# EAGLE design OperationShield1 (EAGLE 5.12)
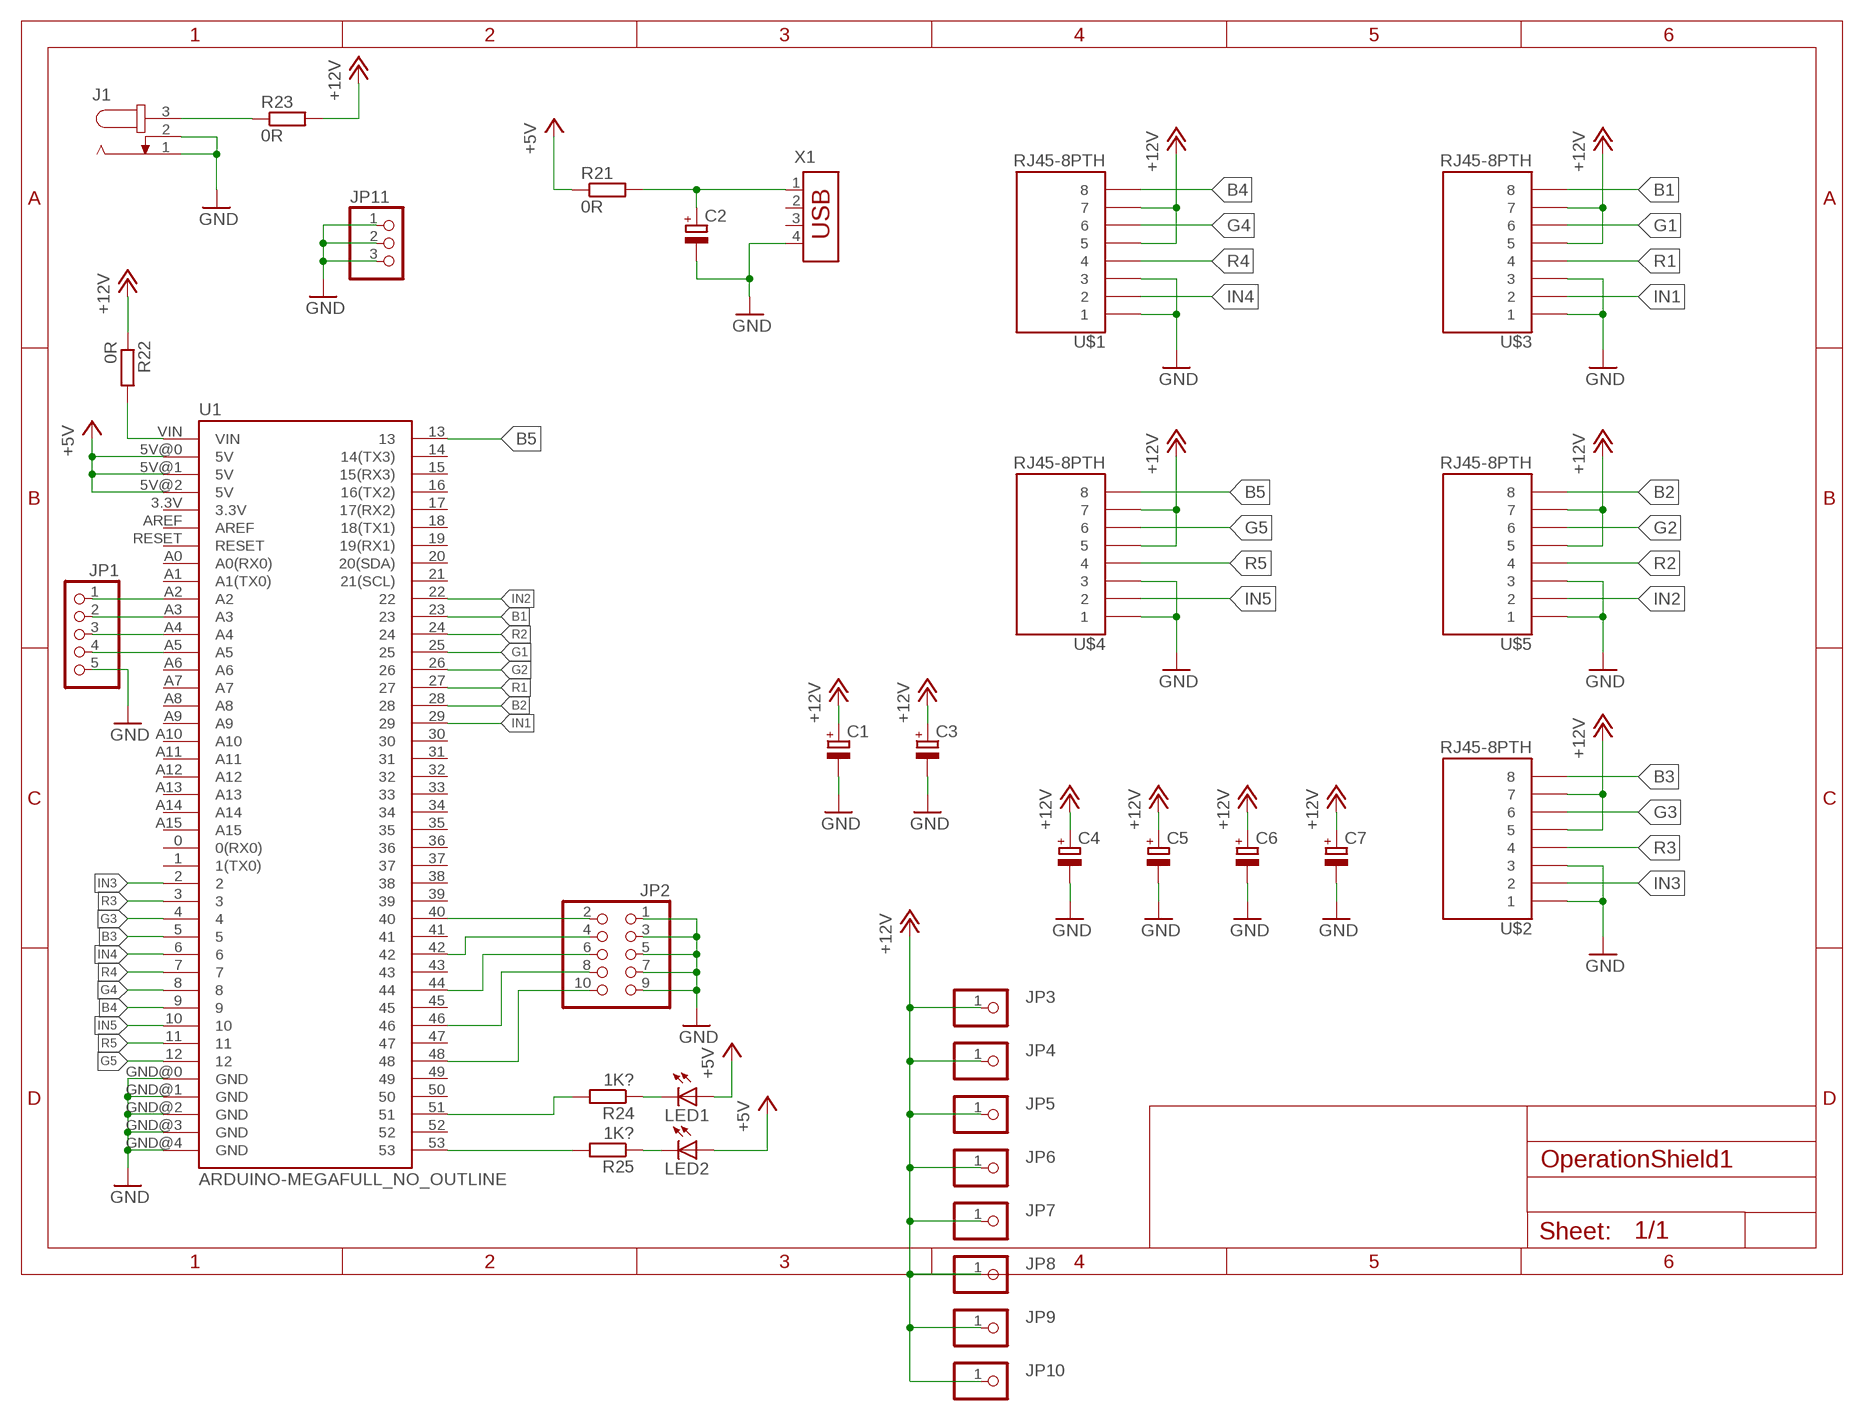
[diagram p0: schematic, sheet 1]

## Parts
C1  CPOL-EUE3.5-10  [E3,5-10]
C2  CPOL-EUE3.5-10  [E3,5-10]
C3  CPOL-EUE3.5-10  [E3,5-10]
C4  CPOL-EUE3.5-10  [E3,5-10]
C5  CPOL-EUE3.5-10  [E3,5-10]
C6  CPOL-EUE3.5-10  [E3,5-10]
C7  CPOL-EUE3.5-10  [E3,5-10]
J1  JACK-PLUG0  [SPC4077]
JP1  PINHD-1X5  [1X05]
JP2  PINHD-2X5  [2X05]
JP3  PINHD-1X1  [1X01]
JP4  PINHD-1X1  [1X01]
JP5  PINHD-1X1  [1X01]
JP6  PINHD-1X1  [1X01]
JP7  PINHD-1X1  [1X01]
JP8  PINHD-1X1  [1X01]
JP9  PINHD-1X1  [1X01]
JP10  PINHD-1X1  [1X01]
JP11  PINHD-1X3  [1X03]
LED1  LED5MM  [LED5MM]
LED2  LED5MM  [LED5MM]
R21  0R  R-EU_0207/10  [0207/10]
R22  0R  R-EU_0207/10  [0207/10]
R23  0R  R-EU_0207/10  [0207/10]
R24  1K?  R-EU_0207/10  [0207/10]
R25  1K?  R-EU_0207/10  [0207/10]
U1  ARDUINO-MEGAFULL_NO_OUTLINE  [ARDUINO_MEGA_NO_OUTLINE]
U$1  RJ45-8PTH  [RJ45-8]
U$2  RJ45-8PTH  [RJ45-8]
U$3  RJ45-8PTH  [RJ45-8]
U$4  RJ45-8PTH  [RJ45-8]
U$5  RJ45-8PTH  [RJ45-8]
X1  USB-787616  [USB]

## Nets
+5V: LED1.A LED2.A R21.1 U1.5V@0(5V) U1.5V@1(5V) U1.5V@2(5V)
+12V [power]: C1.+ C3.+ C4.+ C5.+ C6.+ C7.+ JP3.1 JP4.1 JP5.1 JP6.1 JP7.1 JP8.1 JP9.1 JP10.1 R22.1 R23.2 U$1.5 U$1.7 U$2.5 U$2.7 U$3.5 U$3.7 U$4.5 U$4.7 U$5.5 U$5.7
A2: JP1.1 U1.A2
A3: JP1.2 U1.A3
A4: JP1.3 U1.A4
A5: JP1.4 U1.A5
B1: U1.23 U$3.8
B2: U1.28 U$5.8
B3 [signal]: U1.5 U$2.8
B4: U1.9 U$1.8
B5 [signal]: U1.13 U$4.8
G1: U1.25 U$3.6
G2: U1.26 U$5.6
G3 [signal]: U1.4 U$2.6
G4: U1.8 U$1.6
G5 [signal]: U1.12 U$4.6
GND [power]: C1.- C2.- C3.- C4.- C5.- C6.- C7.- J1.1 J1.2 JP2.1 JP2.3 JP2.5 JP2.7 JP2.9 JP11.1 JP11.2 JP11.3 U1.GND@0(GND) U1.GND@1(GND) U1.GND@2(GND) U1.GND@3(GND) U1.GND@4(GND) U$1.1 U$1.3 U$2.1 U$2.3 U$3.1 U$3.3 U$4.1 U$4.3 U$5.1 U$5.3 X1.4
IN1: U1.29 U$3.2
IN2: U1.22 U$5.2
IN3: U1.2 U$2.2
IN4: U1.6 U$1.2
IN5 [signal]: U1.10 U$4.2
LED1: R24.2 U1.51
LED2: R25.2 U1.53
N$6: JP1.5 ; supply symbol labelled GND
N$21: LED2.K(C) R25.1
N$22: LED1.K(C) R24.1
N$23 [signal]: JP2.10 U1.48
N$24 [signal]: JP2.8 U1.46
N$25 [signal]: JP2.6 U1.44
N$26 [signal]: JP2.4 U1.42
N$27 [signal]: JP2.2 U1.40
R1: U1.27 U$3.4
R2: U1.24 U$5.4
R3 [signal]: U1.3 U$2.4
R4: U1.7 U$1.4
R5 [signal]: U1.11 U$4.4
USB_V+ [power]: C2.+ R21.2 X1.1
VIN [power]: R22.2 U1.VIN
VJACK [power]: J1.3 R23.1
Unconnected: U1.0(0(RX0)) U1.1(1(TX0)) U1.3.3V U1.14(14(TX3)) U1.15(15(RX3)) U1.16(16(TX2)) U1.17(17(RX2)) U1.18(18(TX1)) U1.19(19(RX1)) U1.20(20(SDA)) U1.21(21(SCL)) U1.30 U1.31 U1.32 U1.33 U1.34 U1.35 U1.36 U1.37 U1.38 U1.39 U1.41 U1.43 U1.45 U1.47 U1.49 U1.50 U1.52 U1.A0(A0(RX0)) U1.A1(A1(TX0)) U1.A6 U1.A7 U1.A8 U1.A9 U1.A10 U1.A11 U1.A12 U1.A13 U1.A14 U1.A15 U1.AREF U1.RESET X1.2 X1.3

## Library data of the parts
C1-C7 = rcl:CPOL-EU: POLARIZED CAPACITOR, European symbol
J1 = con-jack:JACK-PLUG: DC POWER JACK Power Jack, DC, Right Angle, Through Hole, Rated 5A at 16VDC, PC Terminals Distributor: Farnell (www.Farnell.de) Drawing: 84N1161.pdf / 84N1162.pdf Manufacturer: SPC Technology (www.spctechnology.com) Type: SPC4077 / SPC 4078; OC_FARNELL: unknown; OC_NEWARK: unknown
JP1 = pinhead:PINHD-1X5: PIN HEADER
JP2 = pinhead:PINHD-2X5: PIN HEADER
JP3-JP10 = pinhead:PINHD-1X1: PIN HEADER
JP11 = pinhead:PINHD-1X3: PIN HEADER
LED1 LED2 = led:LED: LED OSRAM: - CHIPLED LG R971, LG N971, LY N971, LG Q971, LY Q971, LO R971, LY R971 LH N974, LH R974 LS Q976, LO Q976, LY Q976 LO Q996 - Hyper CHIPLED LW Q18S LB Q993, LB Q99A, LB R99A - SideLED LS A670, LO A670, LY A670, LG A670, LP A670 LB A673, LV A673, LT A673, LW A673 LH A674 LY A675 LS A676, LA A676, LO A676, LY A676, LW A676 LS A679, LY A679, LG A679 - Hyper Micro SIDELED® LS Y876, LA Y876, LO Y876, LY Y876 LT Y87S - SmartLED LW L88C, LW L88S LB L89C, LB L89S, LG L890 LS L89K, LO L89K, LY L89K LS L896, LA L896, LO L896, LY L896 - TOPLED LS T670, LO T670, LY T670, LG T670, LP T670 LSG T670, LSP T670, LSY T670, LOP T670, LYG T670 LG T671, LOG T671, LSG T671 LB T673, LV T673, LT T673, LW T673 LH T674 LS T676, LA T676, LO T676, LY T676, LB T676, LH T676, LSB T676, LW T676 LB T67C, LV T67C, LT T67C, LS T67K, LO T67K, LY T67K, LW E67C LS E67B, LA E67B, LO E67B, LY E67B, LB E67C, LV E67C, LT E67C LW T67C LS T679, LY T679, LG T679 LS T770, LO T770, LY T770, LG T770, LP T770 LB T773, LV T773, LT T773, LW T773 LH T774 LS E675, LA E675, LY E675, LS T675 LS T776, LA T776, LO T776, LY T776, LB T776 LHGB T686 LT T68C, LB T68C - Hyper Mini TOPLED® LB M676 - Mini TOPLED Santana® LG M470 LS M47K, LO M47K, LY M47K Source: http://www.osram.convergy.de LUXEON: - LUMILED® LXK2-PW12-R00, LXK2-PW12-S00, LXK2-PW14-U00, LXK2-PW14-V00 LXK2-PM12-R00, LXK2-PM12-S00, LXK2-PM14-U00 LXK2-PE12-Q00, LXK2-PE12-R00, LXK2-PE12-S00, LXK2-PE14-T00, LXK2-PE14-U00 LXK2-PB12-K00, LXK2-PB12-L00, LXK2-PB12-M00, LXK2-PB14-N00, LXK2-PB14-P00, LXK2-PB14-Q00 LXK2-PR12-L00, LXK2-PR12-M00, LXK2-PR14-Q00, LXK2-PR14-R00 LXK2-PD12-Q00, LXK2-PD12-R00, LXK2-PD12-S00 LXK2-PH12-R00, LXK2-PH12-S00 LXK2-PL12-P00, LXK2-PL12-Q00, LXK2-PL12-R00 Source: www.luxeon.com KINGBRIGHT: KA-3528ASYC Source: www.kingbright.com
R21-R25 = resistor:R-EU_: RESISTOR, European symbol
U1 = SparkFun:ARDUINO-MEGA: Arduino Mega footprint connections
U$1-U$5 = SparkFun:RJ45-8: RJ45 Jack Simple RJ45, 8-pin connection - connector for common Cat5, Cat5e, and Cat6 Ethernet cables. Footprint not yet proven in production. Connector sku is PRT-00643; Breakout PCB sku is BOB-00716.
X1 = con-amp:USB-787616: AMP connector; MF: TYCO ELECTRONICS; MPN: 787616-1; OC_FARNELL: unknown; OC_NEWARK: 83F4514

## Net classes
1 signal: width 0.406 mm, clearance 0.406 mm
2 power: width 0.61 mm, clearance 0.406 mm

## Board
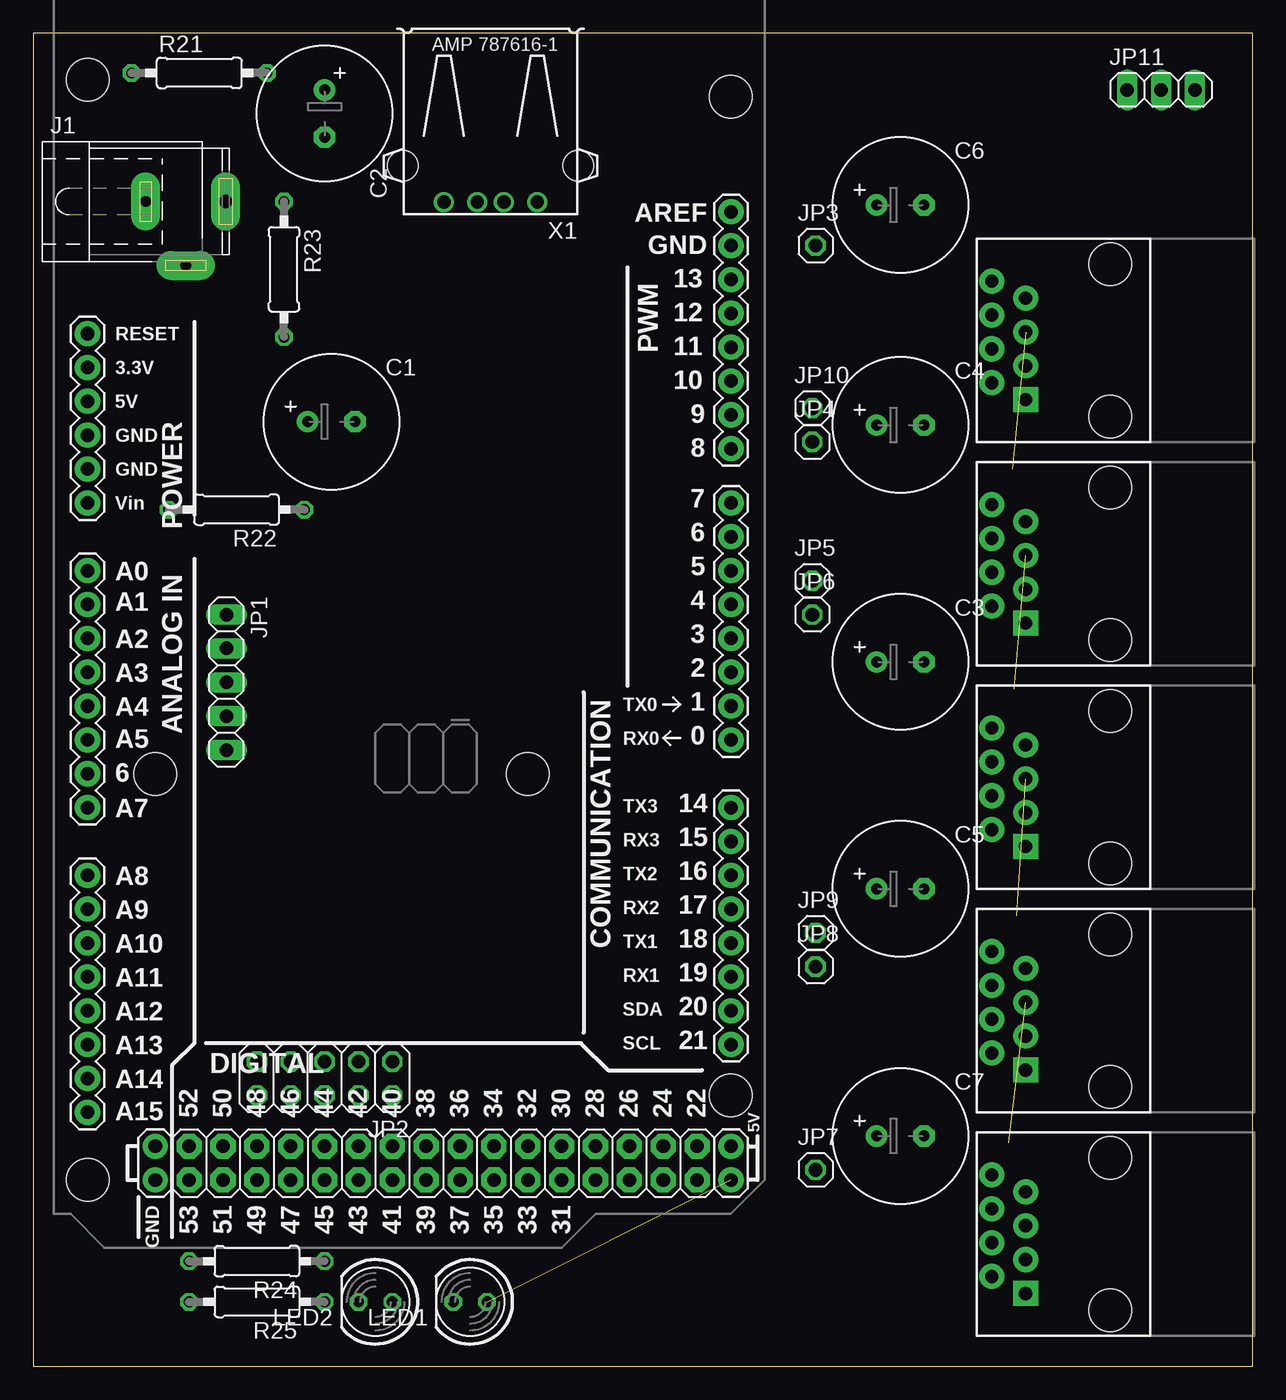
[diagram p1: board, top side]
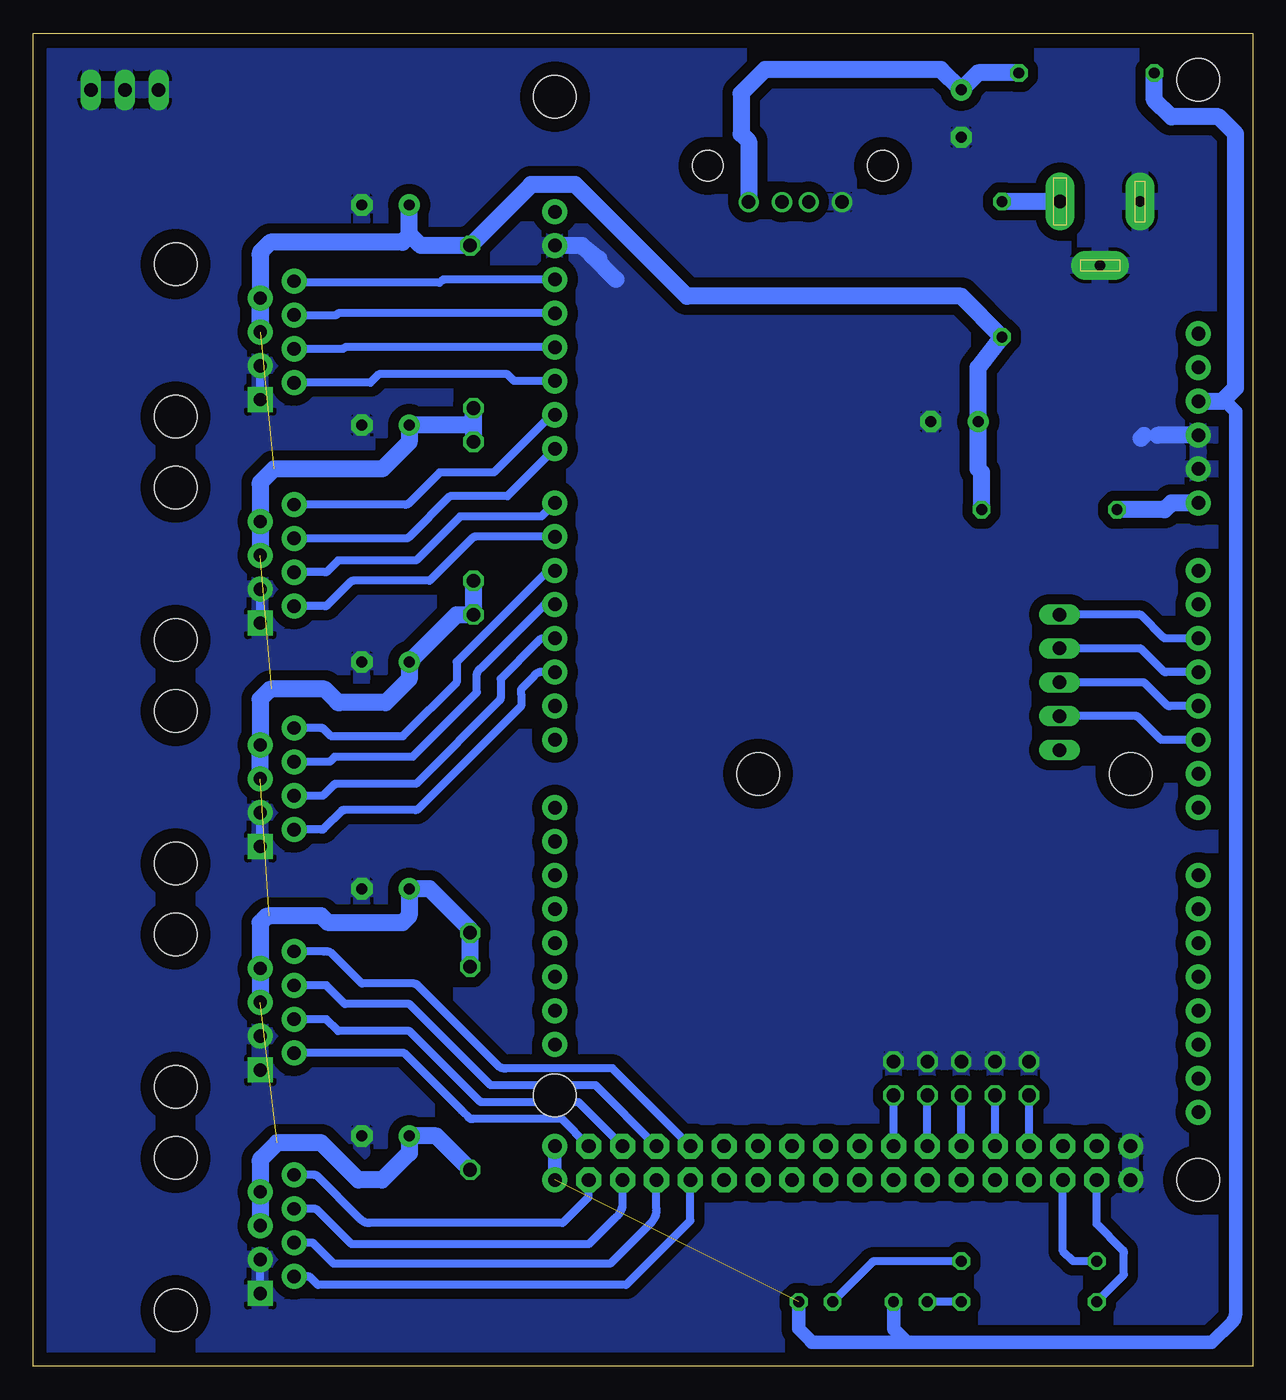
[diagram p2: board, bottom side, seen from below]

Size 91.44 x 100 mm. Coordinates in mm from the lower left corner, seen from the top.
Outline: 0,0 91.44,0 91.44,100 0,100 0,0
Copper layers (1*16): Top 0.035mm / dielectric 1.5mm / Bottom 0.035mm
Design rules "default": minimum track width 10mil, minimum drill 24mil, track to track 8mil, track to pad 8mil, pad to pad 8mil, via to via 8mil, smd to smd 8mil, copper to edge 40mil, drill to drill 8mil, minimum pad ring 10mil, minimum via ring 8mil, stop-mask expansion 4mil, vias tented up to drill 0mil, thermal gap 10mil

### Footprints (pad centres in the part's own frame; a part is rotated, then mirrored left to right if it is on the bottom)
E3,5-10 = drill 0.813 pad 1.6 round: + -1.778,0 | drill 0.813 pad 1.6 octagon: - 1.778,0
SPC4077 = drill 0.8 pad 2.184 long: 1 -3,0; 2 0,-4.8 | drill 1 pad 2.184 long: 3 3,0
1X05 = drill 1.016 long: 1 -5.08,0; 2 -2.54,0; 3 0,0; 4 2.54,0; 5 5.08,0
2X05 = drill 1.016 octagon: 1 -5.08,-1.27; 2 -5.08,1.27; 3 -2.54,-1.27; 4 -2.54,1.27; 5 0,-1.27; 6 0,1.27; 7 2.54,-1.27; 8 2.54,1.27; 9 5.08,-1.27; 10 5.08,1.27
1X01 = drill 1.016 octagon: 1 0,0
1X03 = drill 1.016 long: 1 -2.54,0; 2 0,0; 3 2.54,0
LED5MM = drill 0.813 octagon: A -1.27,0; K 1.27,0
0207/10 = drill 0.813 octagon: 1 -5.08,0; 2 5.08,0
ARDUINO_MEGA_NO_OUTLINE = drill 1.016 pad 1.88 round: 0 63.5,50.8; 1 60.96,50.8; 2 58.42,50.8; 3 55.88,50.8; 3.3V 35.56,2.54; 4 53.34,50.8; 5 50.8,50.8; 5V@0 38.1,2.54; 5V@1 93.98,50.8; 5V@2 96.52,50.8; 6 48.26,50.8; 7 45.72,50.8; 8 41.656,50.8; 9 39.116,50.8; 10 36.576,50.8; 11 34.036,50.8; 12 31.496,50.8; 13 28.956,50.8; 14 68.58,50.8; 15 71.12,50.8; 16 73.66,50.8; 17 76.2,50.8; 18 78.74,50.8; 19 81.28,50.8; 20 83.82,50.8; 21 86.36,50.8; A0 50.8,2.54; A1 53.34,2.54; A2 55.88,2.54; A3 58.42,2.54; A4 60.96,2.54; A5 63.5,2.54; A6 66.04,2.54; A7 68.58,2.54; A8 73.66,2.54; A9 76.2,2.54; A10 78.74,2.54; A11 81.28,2.54; A12 83.82,2.54; A13 86.36,2.54; A14 88.9,2.54; A15 91.44,2.54; AREF 23.876,50.8; GND@0 40.64,2.54; GND@1 43.18,2.54; GND@2 93.98,7.62; GND@3 96.52,7.62; GND@4 26.416,50.8; RESET 33.02,2.54; VIN 45.72,2.54 | drill 1.016 pad 1.88 octagon: 22 93.98,48.26; 23 96.52,48.26; 24 93.98,45.72; 25 96.52,45.72; 26 93.98,43.18; 27 96.52,43.18; 28 93.98,40.64; 29 96.52,40.64; 30 93.98,38.1; 31 96.52,38.1; 32 93.98,35.56; 33 96.52,35.56; 34 93.98,33.02; 35 96.52,33.02; 36 93.98,30.48; 37 96.52,30.48; 38 93.98,27.94; 39 96.52,27.94; 40 93.98,25.4; 41 96.52,25.4; 42 93.98,22.86; 43 96.52,22.86; 44 93.98,20.32; 45 96.52,20.32; 46 93.98,17.78; 47 96.52,17.78; 48 93.98,15.24; 49 96.52,15.24; 50 93.98,12.7; 51 96.52,12.7; 52 93.98,10.16; 53 96.52,10.16 | hole 3.2: 15.24,50.8; 13.97,2.54; 66.04,35.56; 66.04,7.62; 90.17,50.8; 96.52,2.54
RJ45-8 = drill 1 pad 1.88 square: 1 -4.445,6.35 | drill 1 pad 1.88 round: 2 -3.175,8.89; 3 -1.905,6.35; 4 -0.635,8.89; 5 0.635,6.35; 6 1.905,8.89; 7 3.175,6.35; 8 4.445,8.89 | hole 3.2: -5.715,0; 5.715,0
USB = drill 1 round: 1 -3.5,12.99; 2 -1,12.99; 3 1,12.99; 4 3.5,12.99 | hole 2.3: -6.57,10.28; 6.57,10.28

### Placement (x,y rotation side)
C1  22.35,70.87 0 top
C2  21.84,93.98 270 top
C3  65.02,52.83 0 top
C4  65.02,70.61 0 top
C5  65.02,35.81 0 top
C6  65.02,87.12 0 top
C7  65.02,17.27 0 top
J1  11.43,87.38 0 top
JP1  14.48,51.31 270 top
JP2  21.84,21.59 180 top
JP3  58.67,84.07 0 top
JP4  58.42,69.34 0 top
JP5  58.42,58.93 0 top
JP6  58.42,56.39 0 top
JP7  58.67,14.73 0 top
JP8  58.67,29.97 0 top
JP9  58.67,32.51 0 top
JP10  58.42,71.88 0 top
JP11  84.58,95.76 0 top
LED1  32.77,4.83 180 top
LED2  25.65,4.83 180 top
R21  12.45,97.03 0 top
R22  15.24,64.26 180 top
R23  18.8,82.3 270 top
R24  16.76,7.87 180 top
R25  16.76,4.83 180 top
U1  1.52,110.49 270 top
U$1  80.77,60.2 90 top
U$2  80.77,43.43 90 top
U$3  80.77,9.91 90 top
U$4  80.77,76.96 90 top
U$5  80.77,26.67 90 top
X1  34.29,100.33 180 top

### Tracks (layer width: path | path; a pad name or v marks a point on that pad's centre or on a via)
+5V  (1 unrouted)
  Bottom 1.016: U1.5V@0 2.03,72.39 1.27,71.63 1.27,3.92 arc45 1.6,3.23 3.05,1.78 25.91,1.78 | 25.91,1.78 32.91,1.78 arc45 33.09,1.85 34.04,2.79 LED1.A | LED2.A 26.92,2.9 arc-45 26.85,2.72 25.91,1.78 | U1.5V@2 U1.5V@1
  Bottom 1.27: U1.5V@0 2.29,72.39 1.27,73.41 1.27,92.46 2.54,93.73 6.1,93.73 7.37,95 R21.1
+12V  (4 unrouted)
  Bottom 0.61: U$2.7 74.42,44.45
  Bottom 1.27: 63.25,84.94 C6.+ | 63.25,84.94 arc45 63.32,84.76 63.75,84.33 73.66,84.33 74.3,83.69 arc-45 74.42,83.4 U$4.5 U$4.7 | U$1.5 U$1.7 74.42,66.19 arc45 74.35,66.37 73.41,67.31 65.38,67.31 arc-45 65.2,67.38 63.32,69.27 arc-45 63.25,69.45 C4.+ 58.84,70.61 arc-45 58.55,70.73 JP10.1 JP4.1 | U$3.5 U$3.7 74.42,15.39 arc45 74.35,15.57 73.15,16.76 69.95,16.76 arc45 69.78,16.69 67.06,13.97 65.28,13.97 63.25,16 C7.+ 61.21,17.27 JP7.1 | U$5.5 U$5.7 74.42,33.27 74.03,33.66 arc45 73.75,33.78 69.85,33.78 69.46,33.39 arc-45 69.17,33.27 63.75,33.27 63.37,33.66 arc-45 63.25,33.95 C5.+ 61.72,35.81 58.79,32.88 arc45 58.67,32.6 JP9.1 JP8.1 | U$2.7 74.42,50.04 73.73,50.73 arc45 73.56,50.8 69.6,50.8 68.65,49.86 arc-45 68.47,49.78 65.02,49.78 63.32,51.49 arc-45 63.25,51.67 C3.+ 59.69,56.39 JP6.1 JP5.1 | U$2.5 74.42,44.45 74.42,46.38 arc-45 74.5,46.56 74.68,46.74 | 63.25,84.94 62.38,84.07 JP3.1 54.1,88.65 50.8,88.65 42.42,80.26 21.84,80.26 R23.2 20.57,74.93 C1.+ 20.57,67.31 20.32,67.06 R22.1
A2
  Bottom 0.61: U1.A2 6.5,54.61 arc45 6.68,54.68 8.31,56.31 arc-45 8.49,56.39 JP1.1
A3
  Bottom 0.61: JP1.2 8.49,53.85 arc45 8.31,53.77 6.68,52.14 arc-45 6.5,52.07 U1.A3
A4
  Bottom 0.61: U1.A4 6.25,49.53 arc45 6.42,49.6 8.05,51.23 arc-45 8.23,51.31 JP1.3
A5
  Bottom 0.61: U1.A5 6.75,46.99 arc45 6.93,47.06 8.56,48.69 arc-45 8.74,48.77 JP1.4
B1
  Bottom 0.61: U1.23 49.78,12.8 arc45 49.86,12.63 51.74,10.74 66.26,10.74 arc45 66.95,11.07 70.16,14.28 arc-45 70.34,14.35 U$3.8
B2
  Bottom 0.61: U$5.8 69.64,31.11 arc45 69.1,31 66.8,28.7 62.91,28.7 arc45 62.62,28.58 56.51,22.47 arc-45 55.97,22.35 48.01,22.35 U1.28
B3
  Bottom 0.61: U$2.8 69.83,47.88 arc45 69.65,47.8 69.09,47.24 63.86,47.24 arc-45 63.68,47.32 59.69,51.31 59.69,52.83 52.83,59.69 U1.5
B4
  Bottom 0.61: U$1.8 63.54,64.64 arc-45 63.25,64.76 60.96,67.06 56.9,67.06 52.58,71.37 U1.9
B5
  Bottom 0.61: U1.13 60.6,81.53 arc-45 60.78,81.46 60.96,81.28 71.65,81.28 arc45 71.83,81.35 U$4.8
G1
  Bottom 0.61: U1.25 47.24,12.04 arc45 47.83,11.1 49.78,9.14 67.56,9.14 70.16,11.74 arc-45 70.59,11.81 U$3.6
G2
  Bottom 0.61: U$5.6 69.47,28.57 68.07,27.18 63.25,27.18 57.15,21.08 49.28,21.08 U1.26
G3
  Bottom 0.61: U1.4 52.73,57.15 arc-45 53.16,57.08 57.84,52.4 arc-45 58.17,51.97 58.17,50.55 62.97,45.74 arc45 63.02,45.72 68.83,45.72 69.14,45.41 arc45 69.32,45.34 U$2.6
G4
  Bottom 0.61: U$1.6 63.54,62.1 arc-45 63.25,62.22 60.2,65.28 55.88,65.28 U1.8
G5
  Bottom 0.61: U1.12 68.58,78.99 68.71,78.87 U$4.6
GND
  Bottom 0.61: U$2.1 U$2.3 | U$4.1 U$4.3 | U$3.1 U$3.3 | U$1.1 U$1.3
  Bottom 1.27: U1.GND@4 50.29,84.07 49.02,83.06 49.53,83.31 47.75,81.53 | 8.13,69.85 8.38,69.6 | U1.GND@0 7.11,69.85
  pour Bottom (isolate 0.762): 0.76,0.51 89.92,0.51 arc90 90.17,0.76 90.17,98.3 1.02,98.3 arc90 0.76,98.04
IN1
  Bottom 0.61: U$3.2 70.84,6.73 arc45 70.67,6.66 70.1,6.1 46.99,6.1 42.16,10.92 U1.29
IN2
  Bottom 0.61: U$5.2 63.63,23.5 59.31,19.18 59.18,19.05 58.79,18.66 arc-45 58.51,18.54 51.82,18.54 U1.22
IN3
  Bottom 0.61: U$2.2 69.83,40.26 arc-45 69.65,40.33 68.33,41.66 arc45 68.15,41.73 62.77,41.73 arc-45 62.59,41.8 54.86,49.53 54.86,50.44 arc45 54.79,50.87 53.92,51.74 arc45 53.49,52.07 U1.2
IN4
  Bottom 0.61: U1.6 58.31,62.23 arc-45 58.49,62.16 61.72,58.93 67.46,58.93 arc-45 67.64,58.85 69.39,57.1 arc45 69.57,57.02 U$1.2
IN5
  Bottom 0.61: U1.10 55.37,73.91 55.88,74.42 65.53,74.42 66.17,73.79 U$4.2
LED1
  Bottom 0.61: R24.2 13.46,7.87 14.22,8.64 U1.51
LED2
  Bottom 0.61: U1.53 11.68,10.67 9.73,8.71 arc45 9.65,8.53 9.65,6.86 R25.2
N$21
  Bottom 0.61: R25.1 LED2.K
N$22
  Bottom 0.61: R24.1 28.34,7.87 arc-45 28.52,7.8 LED1.K
N$23
  Bottom 0.61: U1.48 JP2.10
N$24
  Bottom 0.61: U1.46 JP2.8
N$25
  Bottom 0.61: U1.44 JP2.6
N$26
  Bottom 0.61: U1.42 JP2.4
N$27
  Bottom 0.61: U1.40 JP2.2
R1
  Bottom 0.61: U1.27 44.7,11.79 arc45 45.03,10.85 48.19,7.69 68.8,7.69 arc45 68.98,7.77 70.41,9.2 arc-45 70.59,9.27 U$3.4
R2
  Bottom 0.61: U$5.4 69.47,26.04 68.58,25.15 63.25,25.15 58.03,19.93 arc-45 57.74,19.81 50.55,19.81 U1.24
R3
  Bottom 0.61: U$2.4 69.83,42.8 arc-45 69.65,42.87 68.91,43.61 arc45 68.73,43.69 62.74,43.69 56.46,49.96 arc-45 56.39,50.14 56.39,51.56 53.67,54.28 arc45 53.23,54.61 U1.3
R4
  Bottom 0.61: U$1.4 69.57,59.56 arc-45 69.39,59.64 68.58,60.45 62.84,60.45 arc-45 62.66,60.53 59.44,63.75 53.34,63.75 U1.7
R5
  Bottom 0.61: U1.11 68.07,76.45 68.2,76.33 U$4.4
USB_V+
  Bottom 1.27: R21.2 20.57,97.03 C2.+ 23.37,97.28 36.58,97.28 38.35,95.5 38.35,92.46 37.79,91.89 X1.1
VIN
  Bottom 1.27: U1.VIN 6.1,64.77 6.6,64.26 R22.2
VJACK
  Bottom 1.27: J1.3 R23.1